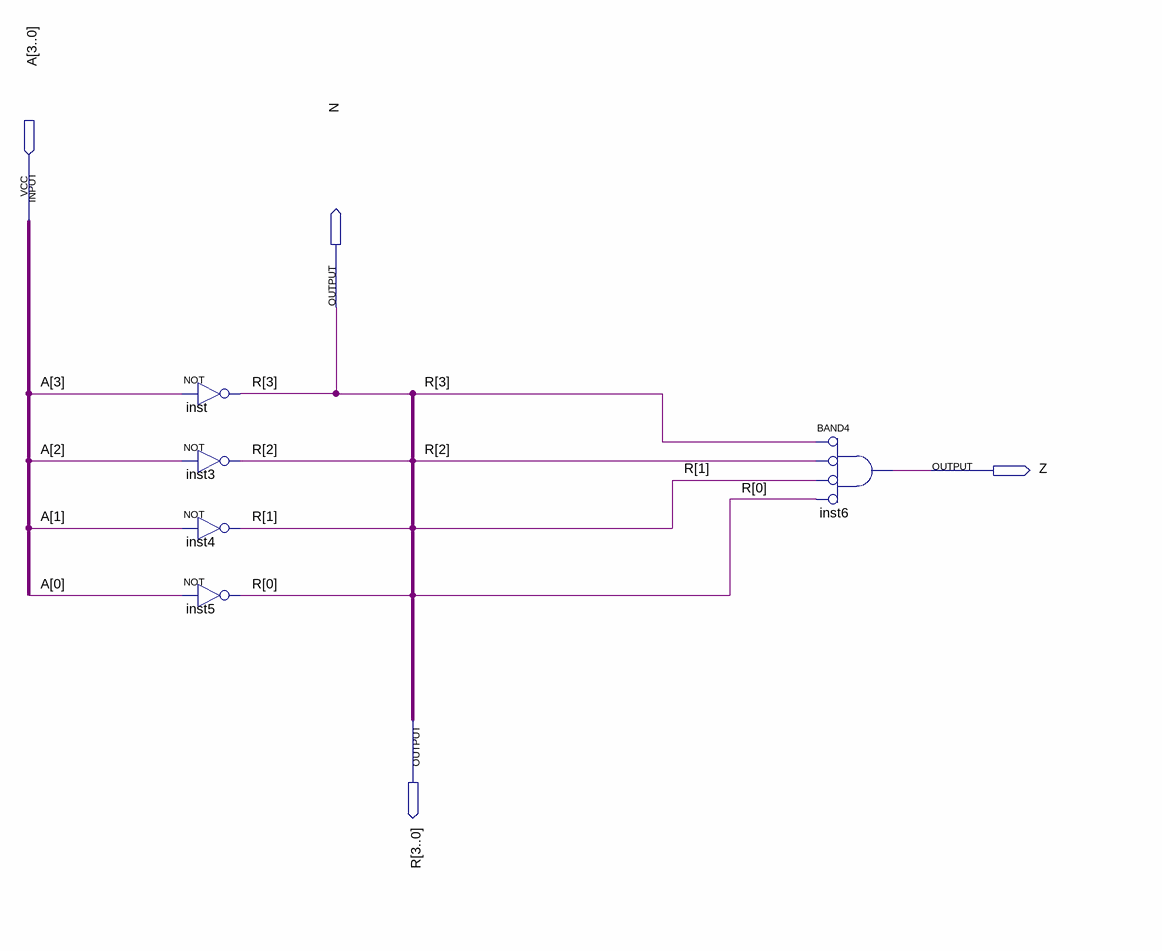
[diagram p0: schematic sheet]
// Quartus schematic Negador.bdf as structural Verilog: 5 symbols, 4 pins
module Negador (
  input  [3:0] A,
  output N,
  output Z,
  output [3:0] R
);

  not inst (N, A[3]);
  not inst3 (R[2], A[2]);
  not inst4 (R[1], A[1]);
  not inst5 (R[0], A[0]);
  and inst6 (Z, ~N, ~R[2], ~R[1], ~R[0]);  // BAND4

  assign R[3] = N;
endmodule
